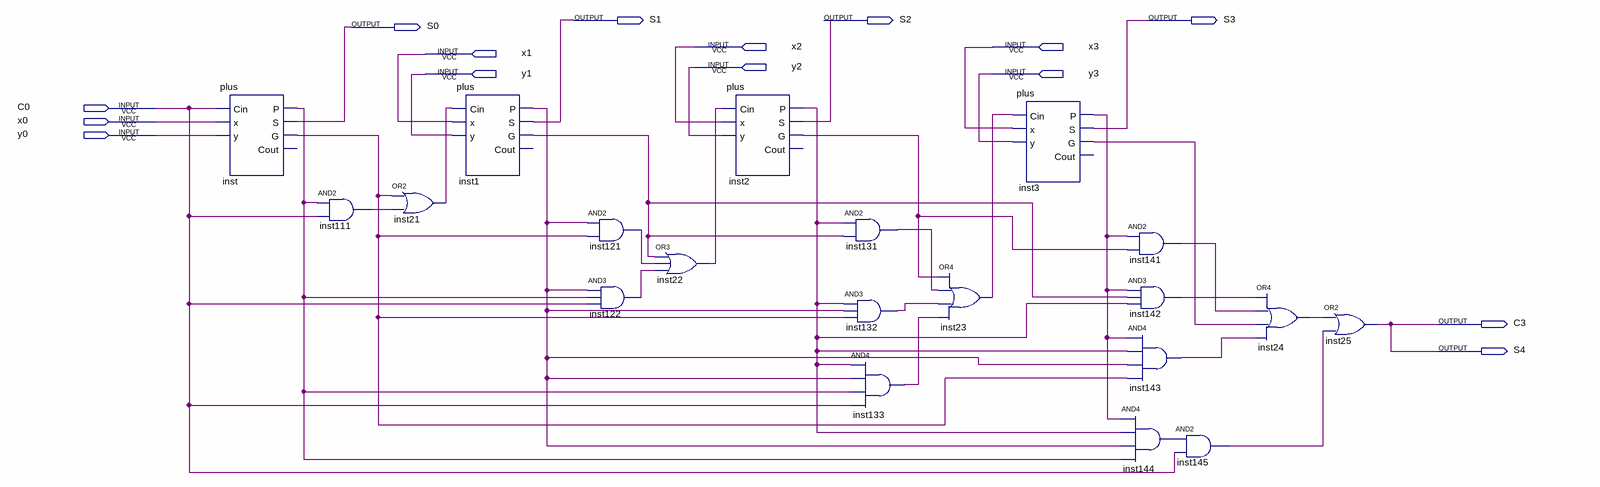
[diagram p0: schematic sheet]
// Quartus schematic lab7.bdf as structural Verilog: 20 symbols, 15 pins
module lab7 (
  input  x2,
  input  x3,
  input  x1,
  input  y2,
  input  y1,
  input  y3,
  input  C0,
  input  x0,
  input  y0,
  output S1,
  output S2,
  output S3,
  output S0,
  output C3,
  output S4
);

  wire inst1_g, inst1_p, inst2_g, inst2_p, inst3_g, inst3_p, inst21_out, inst22_out, inst23_out, inst24_out,
       inst111_out, inst121_out, inst122_out, inst131_out, inst132_out, inst133_out, inst141_out,
       inst142_out, inst143_out, inst144_out, inst145_out, inst_g, inst_p;

  plus inst (.Cin(C0), .x(x0), .y(y0), .P(inst_p), .S(S0), .G(inst_g));  // open: Cout
  and inst111 (inst111_out, inst_p, C0);
  or inst21 (inst21_out, inst_g, inst111_out);
  plus inst1 (.Cin(inst21_out), .x(x1), .y(y1), .P(inst1_p), .S(S1), .G(inst1_g));  // open: Cout
  and inst121 (inst121_out, inst1_p, inst_g);
  and inst122 (inst122_out, inst1_p, inst_p, C0);
  or inst22 (inst22_out, inst1_g, inst121_out, inst122_out);
  plus inst2 (.Cin(inst22_out), .x(x2), .y(y2), .P(inst2_p), .S(S2), .G(inst2_g));  // open: Cout
  and inst131 (inst131_out, inst2_p, inst1_g);
  and inst132 (inst132_out, inst2_p, inst1_p, inst_g);
  and inst133 (inst133_out, inst2_p, inst1_p, inst_p, C0);
  or inst23 (inst23_out, inst2_g, inst131_out, inst132_out, inst133_out);
  plus inst3 (.Cin(inst23_out), .x(x3), .y(y3), .P(inst3_p), .S(S3), .G(inst3_g));  // open: Cout
  and inst141 (inst141_out, inst3_p, inst2_g);
  and inst142 (inst142_out, inst3_p, inst1_g, inst2_p);
  and inst143 (inst143_out, inst3_p, inst2_p, inst1_p, inst_g);
  and inst144 (inst144_out, inst3_p, inst2_p, inst1_p, inst_p);
  and inst145 (inst145_out, inst144_out, C0);
  or inst24 (inst24_out, inst142_out, inst141_out, inst3_g, inst143_out);
  or inst25 (C3, inst24_out, inst145_out);

  assign S4 = C3;
endmodule
